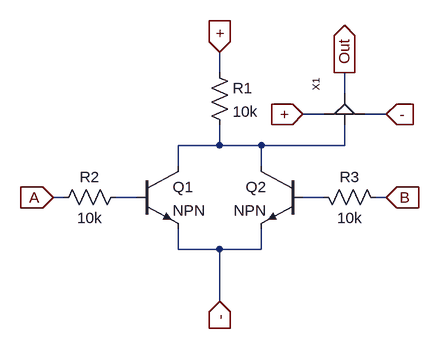
[diagram p0: schematic NOR.asc]
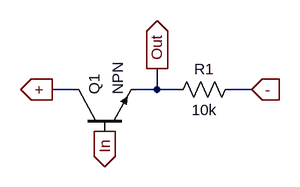
[diagram p1: sub-circuit buffer.asc]
NOR.asc, the LTspice schematic file:
Version 4
SHEET 1 880 680
WIRE 240 -80 240 -112
WIRE 432 -48 432 -80
WIRE 400 -16 368 -16
WIRE 496 -16 464 -16
WIRE 240 32 240 0
WIRE 240 32 176 32
WIRE 304 32 240 32
WIRE 432 32 432 0
WIRE 432 32 304 32
WIRE 176 64 176 32
WIRE 304 64 304 32
WIRE 0 112 -16 112
WIRE 112 112 80 112
WIRE 400 112 368 112
WIRE 496 112 480 112
WIRE 176 192 176 160
WIRE 240 192 176 192
WIRE 304 192 304 160
WIRE 304 192 240 192
WIRE 240 272 240 192
FLAG 240 272 -
IOPIN 240 272 In
FLAG 240 -112 +
IOPIN 240 -112 In
FLAG -16 112 A
IOPIN -16 112 In
FLAG 496 112 B
IOPIN 496 112 In
FLAG 432 -80 Out
IOPIN 432 -80 Out
FLAG 368 -16 +
IOPIN 368 -16 In
FLAG 496 -16 -
IOPIN 496 -16 In
SYMBOL npn 112 64 R0
SYMATTR InstName Q1
SYMBOL npn 368 64 M0
SYMATTR InstName Q2
SYMBOL res 224 -96 R0
SYMATTR InstName R1
SYMATTR Value 10k
SYMBOL res 96 96 R90
WINDOW 0 0 56 VBottom 2
WINDOW 3 32 56 VTop 2
SYMATTR InstName R2
SYMATTR Value 10k
SYMBOL res 384 96 M90
WINDOW 0 0 56 VBottom 2
WINDOW 3 32 56 VTop 2
SYMATTR InstName R3
SYMATTR Value 10k
SYMBOL Buffer 432 0 R270
SYMATTR InstName X1

buffer.asc, the sub-circuit schematic file:
Version 4
SHEET 1 880 680
WIRE 48 112 16 112
WIRE 176 112 176 80
WIRE 176 112 144 112
WIRE 208 112 176 112
WIRE 320 112 288 112
FLAG 176 80 Out
IOPIN 176 80 Out
FLAG 16 112 +
IOPIN 16 112 Out
FLAG 96 176 In
IOPIN 96 176 Out
FLAG 320 112 -
IOPIN 320 112 In
SYMBOL npn 48 176 R270
SYMATTR InstName Q1
SYMBOL res 304 96 R90
WINDOW 0 0 56 VBottom 2
WINDOW 3 32 56 VTop 2
SYMATTR InstName R1
SYMATTR Value 10k

The netlist it stands for:
* NOR.asc
Q1 N001 N002 - 0 NPN
Q2 N001 N003 - 0 NPN
R1 + N001 10k
R2 N002 A 10k
R3 N003 B 10k
XX1 N001 Out + - buffer

* block symbol definitions
.subckt buffer In Out + -
Q1 + In Out 0 NPN
R1 - Out 10k
.ends buffer

.model NPN NPN
.model PNP PNP
.lib standard.bjt
.backanno
.end